# Altium project cncOPTO.PrjPCB
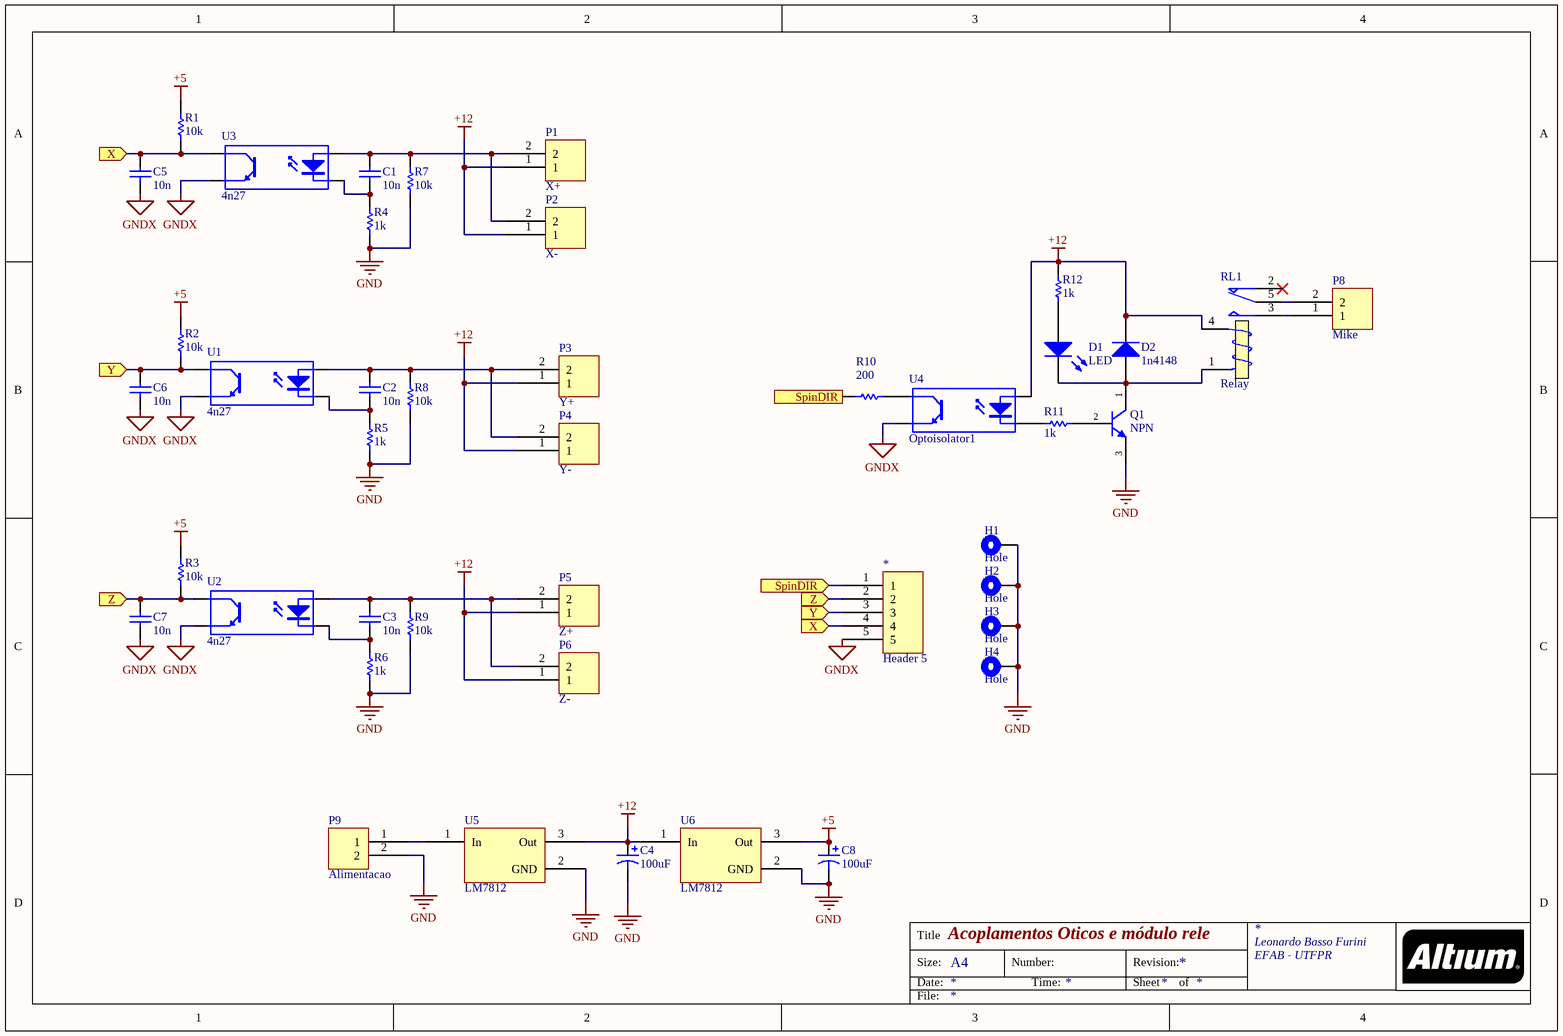
[diagram p0: esquematicoOPTO.SchDoc]
1 sheet, 43 parts. Net scope: flat (ports and power ports of the same name join across sheets).
Board file: optoPCB.PcbDoc

## Sheet esquematicoOPTO.SchDoc: Acoplamentos Oticos e módulo rele
size A4; Address1: Leonardo Basso Furini; Address2: EFAB - UTFPR

### Parts
*  Header 5  [HDR1x5M]
C1  10n  [Capaciotrpoliester]
C2  10n  [Capaciotrpoliester]
C3  10n  [Capaciotrpoliester]
C4  100uF  [cap_rad_d6.3X11POL]
C5  10n  [RAD-0.2]
C6  10n  [RAD-0.2]
C7  10n  [RAD-0.2]
C8  100uF  [cap_rad_d6.3X11POL]
D1  LED  [LED_5MM_GREEN]
D2  1n4148  [Diodo]
H1  Hole  [HOLE_M2]
H2  Hole  [HOLE_M2]
H3  Hole  [HOLE_M2]
H4  Hole  [HOLE_M2]
P1  X+  [KRE-2]
P2  X-  [KRE-2]
P3  Y+  [KRE-2]
P4  Y-  [KRE-2]
P5  Z+  [KRE-2]
P6  Z-  [KRE-2]
P8  Mike  [KRE-2]
P9  Alimentacao  [KRE-2]
Q1  NPN  [TO-92]
R1  10k  [AXIAL-0.4]
R2  10k  [AXIAL-0.4]
R3  10k  [AXIAL-0.4]
R4  1k  [AXIAL-0.4]
R5  1k  [AXIAL-0.4]
R6  1k  [AXIAL-0.4]
R7  10k  [AXIAL-0.4]
R8  10k  [AXIAL-0.4]
R9  10k  [AXIAL-0.4]
R10  200  [AXIAL-0.4]
R11  1k  [AXIAL-0.4]
R12  1k  [AXIAL-0.4]
RL1  Relay  [FINDER-36.11]
U1  4n27  [DIP-6]
U2  4n27  [DIP-6]
U3  4n27  [DIP-6]
U4  Optoisolator1  [DIP-6]
U5  LM7812  [LM7805]
U6  LM7812  [LM7805]

### Ports
SpinDIR (in), X (in), Y (in), Z (in)

### Nets
+5: C8.1 R1.2 R2.2 R3.2 U6.3(Out)
+12: C4.1 D2.2(K) P1.1 P2.1 P3.1 P4.1 P5.1 P6.1 R12.2 RL1.4(T1) U4.1(A) U5.3(Out) U6.1(In)
GND: C4.2 C8.2 H1.1 H2.1 H3.1 H4.1 P9.2 Q1.3(E) R4.1 R5.1 R6.1 R7.2 R8.2 R9.2 U5.2(GND) U6.2(GND)
GNDX: *.5 C5.1 C6.1 C7.1 U1.3(E) U2.3(E) U3.3(E) U4.3(E)
Net*_1: *.1 R10.2 ; port SpinDIR
Net*_2: *.2 C7.2 R3.1 U2.4(C) ; port Z
Net*_3: *.3 C6.2 R2.1 U1.4(C) ; port Y
Net*_4: *.4 C5.2 R1.1 U3.4(C) ; port X
NetC1_1: C1.1 R4.2 U3.2(K)
NetC1_2: C1.2 P1.2 P2.2 R7.1 U3.1(A)
NetC2_1: C2.1 R5.2 U1.2(K)
NetC2_2: C2.2 P3.2 P4.2 R8.1 U1.1(A)
NetC3_1: C3.1 R6.2 U2.2(K)
NetC3_2: C3.2 P5.2 P6.2 R9.1 U2.1(A)
NetD1_1: D1.1(A) R12.1
NetD1_2: D1.2(K) D2.1(A) Q1.1(C) RL1.1(T2)
NetP8_1: P8.1 RL1.3(NO)
NetP8_2: P8.2 RL1.5(COM)
NetP9_1: P9.1 U5.1(In)
NetQ1_2: Q1.2(B) R11.1
NetR10_1: R10.1 U4.4(C)
NetR11_2: R11.2 U4.2(K)

Not connected (* = marked no-connect by the designer): RL1 2(NC)*

### Notes on the sheet
- Title
- Size:
- Date:
- A4
- Number:
- Time:
- Revision:
- Sheet
- of
- File:

### Library data of the parts
C1-C3 C5-C7 = C: Capacitor; Value: 1; Manufacturer: *; PartNumber: *; Package Type: *
C4 C8 = CP: Polarized Capacitor; Manufacturer: *; PartNumber: *; Package Type: *; Value: *
D2 = D: Diode; Manufacturer: *; PartNumber: *; Package Type: *
P1-P6 P8 P9 = Header 2
Q1 = NPN: NPN Bipolar Transistor; Manufacturer: *; PartNumber: *; Package Type: *
R1-R12 = R: Resistor; Value: 0; Manufacturer: *; PartNumber: *; Package Type: *
RL1 = Relay: SPDT Relay; Manufacturer: *; Package Type: *; PartNumber: *
U1-U4 = Optoisolator1: 4-Pin Phototransistor Optocoupler; pin to pad: 3>4 4>5; Manufacturer: *; Package Type: *; PartNumber: *
U5 U6 = LM7805
D1 = LED: Manufacturer: *; PartNumber: *; Package Type: *